# EAGLE design Secondary_Board_1.1 (EAGLE 9.5.0)
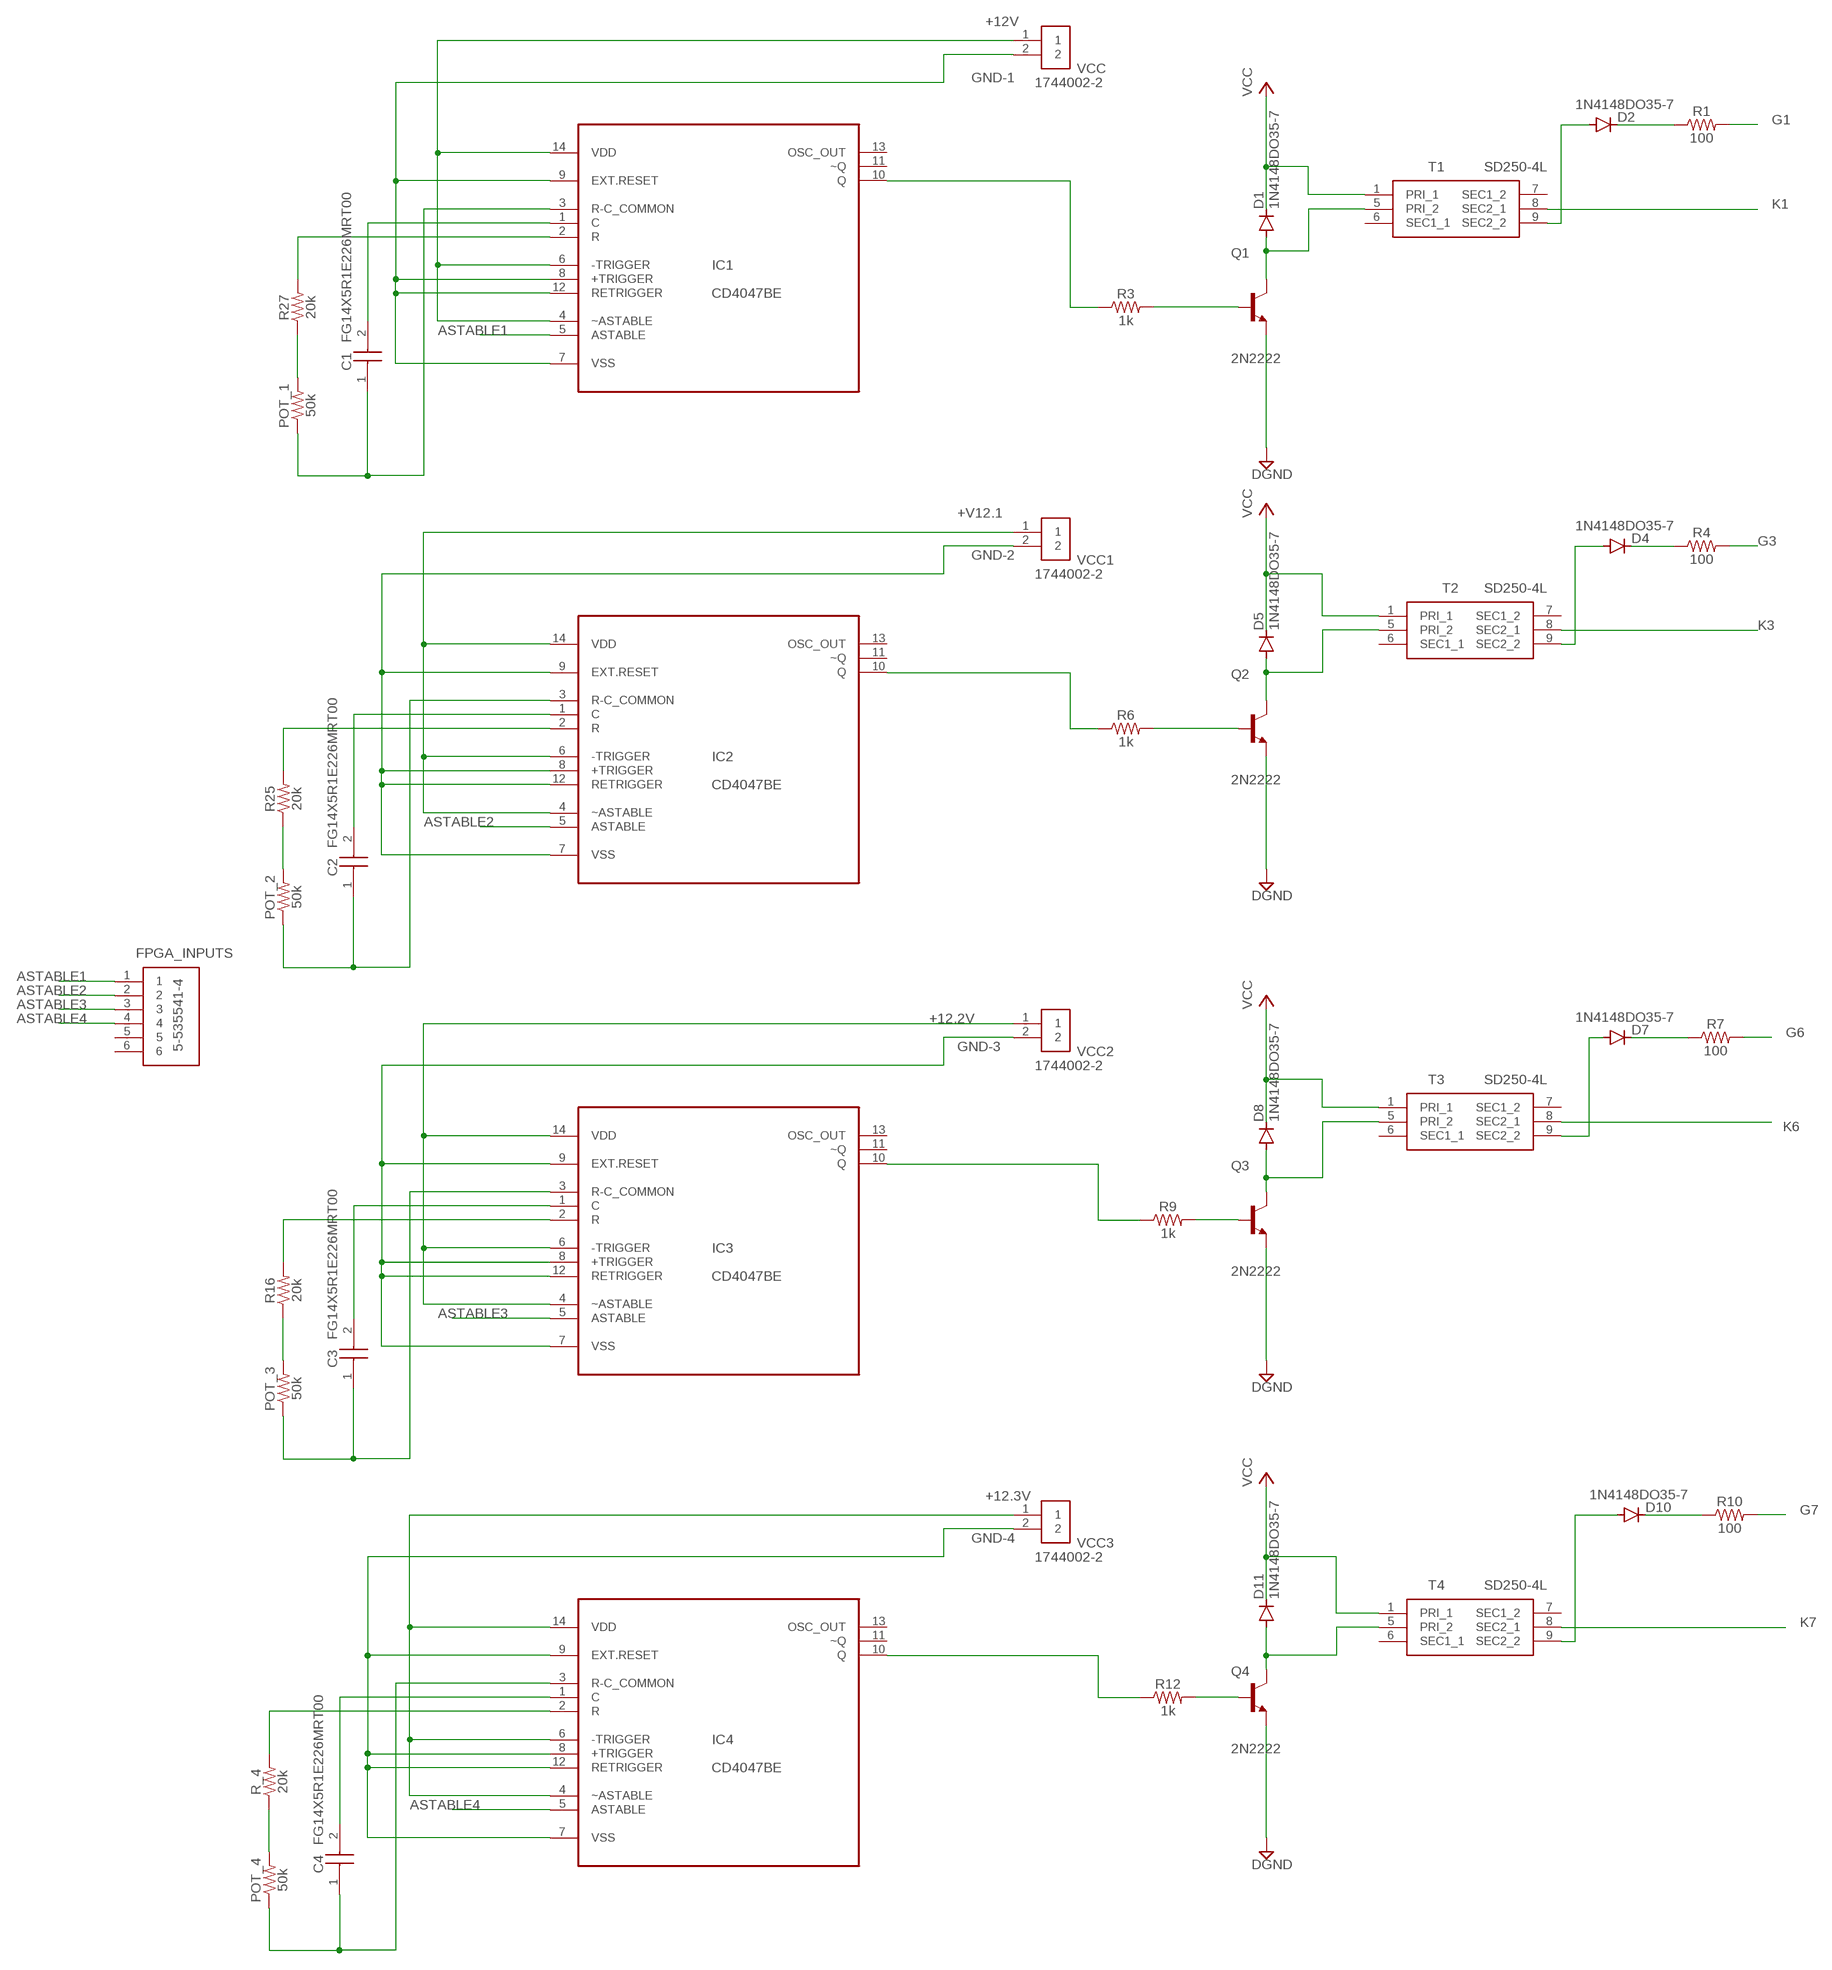
[diagram p0: schematic, sheet 1, part 1 of 2]
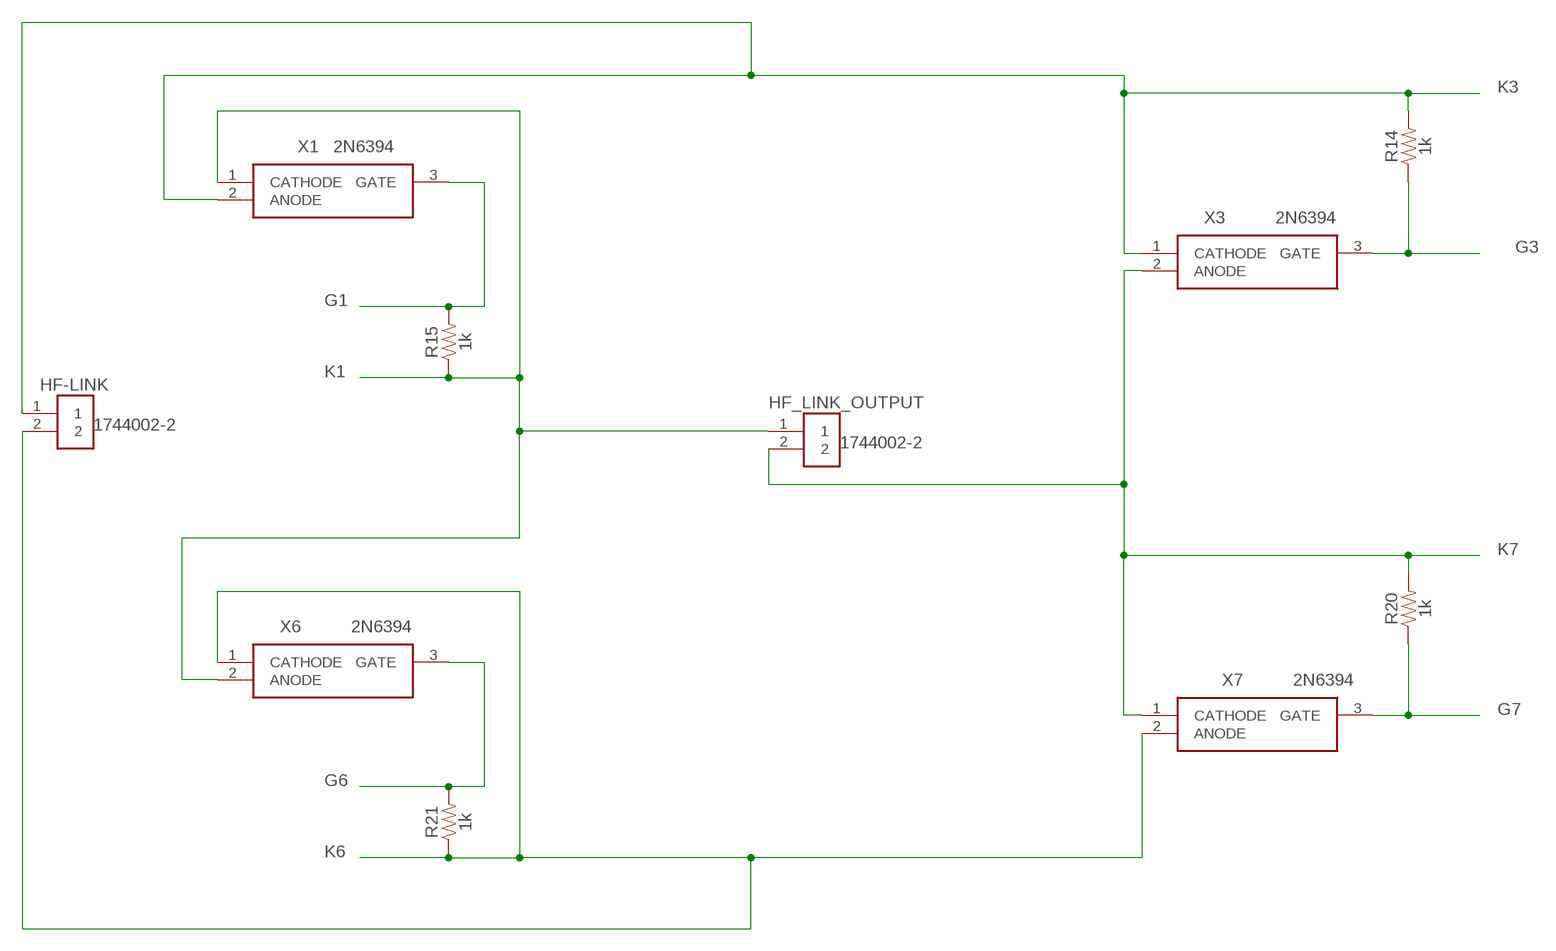
[diagram p1: schematic, sheet 1, part 2 of 2]

## Parts
C1  FG14X5R1E226MRT00  [CAPPRD550W50D395H550]
C2  FG14X5R1E226MRT00  [CAPPRD550W50D395H550]
C3  FG14X5R1E226MRT00  [CAPPRD550W50D395H550]
C4  FG14X5R1E226MRT00  [CAPPRD550W50D395H550]
D1  1N4148DO35-7  [DO35-7]
D2  1N4148DO35-7  [DO35-7]
D4  1N4148DO35-7  [DO35-7]
D5  1N4148DO35-7  [DO35-7]
D7  1N4148DO35-7  [DO35-7]
D8  1N4148DO35-7  [DO35-7]
D10  1N4148DO35-7  [DO35-7]
D11  1N4148DO35-7  [DO35-7]
FPGA_INPUTS  5-535541-4  [SHDR6W76P0X254_1X6_1524X356X62]
HF-LINK  1744002-2  [CONN_1744002-2]
HF_LINK_OUTPUT  1744002-2  [CONN_1744002-2]
IC1  CD4047BE  [DIP254P762X508-14]
IC2  CD4047BE  [DIP254P762X508-14]
IC3  CD4047BE  [DIP254P762X508-14]
IC4  CD4047BE  [DIP254P762X508-14]
POT_1  50k  1KOHM-HORIZ-1/4W-1%  [AXIAL-0.3]
POT_2  50k  1KOHM-HORIZ-1/4W-1%  [AXIAL-0.3]
POT_3  50k  1KOHM-HORIZ-1/4W-1%  [AXIAL-0.3]
POT_4  50k  1KOHM-HORIZ-1/4W-1%  [AXIAL-0.3]
Q1  2N2222  [TO127P584H533-3]
Q2  2N2222  [TO127P584H533-3]
Q3  2N2222  [TO127P584H533-3]
Q4  2N2222  [TO127P584H533-3]
R1  100  100OHM-HORIZ-1/4W-1%  [AXIAL-0.3]
R3  1k  1KOHM-HORIZ-1/4W-1%  [AXIAL-0.3]
R4  100  100OHM-HORIZ-1/4W-1%  [AXIAL-0.3]
R6  1k  1KOHM-HORIZ-1/4W-1%  [AXIAL-0.3]
R7  100  100OHM-HORIZ-1/4W-1%  [AXIAL-0.3]
R9  1k  1KOHM-HORIZ-1/4W-1%  [AXIAL-0.3]
R10  100  100OHM-HORIZ-1/4W-1%  [AXIAL-0.3]
R12  1k  1KOHM-HORIZ-1/4W-1%  [AXIAL-0.3]
R14  1k  1KOHM-HORIZ-1/4W-1%  [AXIAL-0.3]
R15  1k  1KOHM-HORIZ-1/4W-1%  [AXIAL-0.3]
R16  20k  1KOHM-HORIZ-1/4W-1%  [AXIAL-0.3]
R20  1k  1KOHM-HORIZ-1/4W-1%  [AXIAL-0.3]
R21  1k  1KOHM-HORIZ-1/4W-1%  [AXIAL-0.3]
R25  20k  1KOHM-HORIZ-1/4W-1%  [AXIAL-0.3]
R27  20k  1KOHM-HORIZ-1/4W-1%  [AXIAL-0.3]
R_4  20k  1KOHM-HORIZ-1/4W-1%  [AXIAL-0.3]
T1  SD250-4L  [SD2504L]
T2  SD250-4L  [SD2504L]
T3  SD250-4L  [SD2504L]
T4  SD250-4L  [SD2504L]
VCC  1744002-2  [CONN_1744002-2]
VCC1  1744002-2  [CONN_1744002-2]
VCC2  1744002-2  [CONN_1744002-2]
VCC3  1744002-2  [CONN_1744002-2]
X1  2N6394  [TO254P482X997X2018-3P]
X3  2N6394  [TO254P482X997X2018-3P]
X6  2N6394  [TO254P482X997X2018-3P]
X7  2N6394  [TO254P482X997X2018-3P]

## Nets
+12.2V: IC3.4(~ASTABLE) IC3.6(-TRIGGER) IC3.14(VDD) VCC2.1
+12.3V: IC4.4(~ASTABLE) IC4.6(-TRIGGER) IC4.14(VDD) VCC3.1
+12V: IC1.4(~ASTABLE) IC1.6(-TRIGGER) IC1.14(VDD) VCC.1
+V12.1: IC2.4(~ASTABLE) IC2.6(-TRIGGER) IC2.14(VDD) VCC1.1
ASTABLE1: FPGA_INPUTS.1 IC1.5(ASTABLE)
ASTABLE2: FPGA_INPUTS.2 IC2.5(ASTABLE)
ASTABLE3: FPGA_INPUTS.3 IC3.5(ASTABLE)
ASTABLE4: FPGA_INPUTS.4 IC4.5(ASTABLE)
DGND: Q1.1(E) Q2.1(E) Q3.1(E) Q4.1(E)
G1: R1.P$2 R15.P$2 X1.3(GATE)
G3: R4.P$2 R14.P$1 X3.3(GATE)
G6: R7.P$2 R21.P$2 X6.3(GATE)
G7: R10.P$2 R20.P$1 X7.3(GATE)
GND-1: IC1.7(VSS) IC1.8(+TRIGGER) IC1.9(EXT.RESET) IC1.12(RETRIGGER) VCC.2
GND-2: IC2.7(VSS) IC2.8(+TRIGGER) IC2.9(EXT.RESET) IC2.12(RETRIGGER) VCC1.2
GND-3: IC3.7(VSS) IC3.8(+TRIGGER) IC3.9(EXT.RESET) IC3.12(RETRIGGER) VCC2.2
GND-4: IC4.7(VSS) IC4.8(+TRIGGER) IC4.9(EXT.RESET) IC4.12(RETRIGGER) VCC3.2
K1: HF_LINK_OUTPUT.1 R15.P$1 T1.8(SEC2_1) X1.1(CATHODE) X6.2(ANODE)
K3: HF-LINK.1 R14.P$2 T2.8(SEC2_1) X1.2(ANODE) X3.1(CATHODE)
K6: HF-LINK.2 R21.P$1 T3.8(SEC2_1) X6.1(CATHODE) X7.2(ANODE)
K7: HF_LINK_OUTPUT.2 R20.P$2 T4.8(SEC2_1) X3.2(ANODE) X7.1(CATHODE)
N$1: D5.A Q2.3(C) T2.5(PRI_2)
N$2: D1.A Q1.3(C) T1.5(PRI_2)
N$3: D2.C R1.P$1
N$4: IC1.10(Q) R3.P$1
N$5: Q1.2(B) R3.P$2
N$6: D4.A T2.9(SEC2_2)
N$7: IC2.10(Q) R6.P$1
N$8: IC3.10(Q) R9.P$1
N$9: IC4.10(Q) R12.P$1
N$11: D4.C R4.P$1
N$12: D7.A T3.9(SEC2_2)
N$13: Q2.2(B) R6.P$2
N$14: D10.A T4.9(SEC2_2)
N$15: D2.A T1.9(SEC2_2)
N$21: D8.A Q3.3(C) T3.5(PRI_2)
N$24: D7.C R7.P$1
N$25: IC1.2(R) R27.P$2
N$26: POT_1.P$2 R27.P$1
N$27: C1.2(-) IC1.1(C)
N$28: C1.1(+) IC1.3(R-C_COMMON) POT_1.P$1
N$30: IC2.2(R) R25.P$2
N$31: POT_2.P$2 R25.P$1
N$32: C2.2(-) IC2.1(C)
N$33: Q3.2(B) R9.P$2
N$34: C2.1(+) IC2.3(R-C_COMMON) POT_2.P$1
N$36: D11.A Q4.3(C) T4.5(PRI_2)
N$37: D10.C R10.P$1
N$38: IC3.2(R) R16.P$2
N$39: Q4.2(B) R12.P$2
N$40: POT_3.P$2 R16.P$1
N$41: C3.2(-) IC3.1(C)
N$42: C3.1(+) IC3.3(R-C_COMMON) POT_3.P$1
N$44: IC4.2(R) R_4.P$2
N$45: POT_4.P$2 R_4.P$1
N$46: C4.2(-) IC4.1(C)
N$47: C4.1(+) IC4.3(R-C_COMMON) POT_4.P$1
VCC: D1.C D5.C D8.C D11.C T1.1(PRI_1) T2.1(PRI_1) T3.1(PRI_1) T4.1(PRI_1)
Unconnected: FPGA_INPUTS.5 FPGA_INPUTS.6 IC1.11(~Q) IC1.13(OSC_OUT) IC2.11(~Q) IC2.13(OSC_OUT) IC3.11(~Q) IC3.13(OSC_OUT) IC4.11(~Q) IC4.13(OSC_OUT) T1.6(SEC1_1) T1.7(SEC1_2) T2.6(SEC1_1) T2.7(SEC1_2) T3.6(SEC1_1) T3.7(SEC1_2) T4.6(SEC1_1) T4.7(SEC1_2)

## Library data of the parts
C1-C4 = FG14X5R1E226MRT00:FG14X5R1E226MRT00: Multilayer Ceramic Capacitors MLCC - Leaded RAD 25V 22uF X5R 20% LS:2.5mm Source: Datasheet <https://mouser.componentsearchengine.com/Datasheets/1/FG14X5R1E226MRT00.pdf>; DESCRIPTION: Multilayer Ceramic Capacitors MLCC - Leaded RAD 25V 22uF X5R 20% LS:2.5mm; HEIGHT: 5.5mm; MANUFACTURER_NAME: TDK; MANUFACTURER_PART_NUMBER: FG14X5R1E226MRT00
D1 D2 D4 D5 D7 D8 D10 D11 = diode:1N4148: DIODE high speed (Philips)
FPGA_INPUTS = 5-535541-4:5-535541-4: AMP - TE CONNECTIVITY - 5-535541-4 - BOARD-BOARD CONNECTOR, RECEPTACLE, 6 POSITION, 1ROW Source: Datasheet <http://www.te.com/commerce/DocumentDelivery/DDEController?Action=showdoc&DocId=Customer Drawing535541N6pdfEnglishENG_CD_535541_N6.pdf5-535541-4>; ALLIED_NUMBER: 71210170; ALLIED_PRICE-STOCK: https://www.alliedelec.com/te-connectivity-5-535541-4/71210170/; DESCRIPTION: AMP - TE CONNECTIVITY - 5-535541-4 - BOARD-BOARD CONNECTOR, RECEPTACLE, 6 POSITION, 1ROW; HEIGHT: 6.22mm; MANUFACTURER_NAME: TE Connectivity; MANUFACTURER_PART_NUMBER: 5-535541-4; MOUSER_PART_NUMBER: 571-5-535541-4; MOUSER_PRICE-STOCK: https://www.mouser.com/Search/Refine.aspx?Keyword=571-5-535541-4
HF-LINK HF_LINK_OUTPUT VCC VCC1-VCC3 = 1744002-2:1744002-2: CONN HEADER VERT 2POS 3.96MM; AVAILABILITY: Unavailable; DESCRIPTION: CONN HEADER VERT 2POS 3.96MM; MF: TE Connectivity; MP: 1744002-2; PACKAGE: None; PRICE: None; TE_PURCHASE_URL: https://www.te.com/usa-en/product-1744002-2.html?te_bu=Cor&te_type=disp&te_campaign=seda_glo_cor-seda-global-disp-prtnr-fy19-seda-model-bom-cta_sma-317_1&elqCampaignId=32493
IC1-IC4 = CD4047BE:CD4047BE: CMOS Low Power Monostable/Astable Multivibrator; AVAILABILITY: Unavailable; DESCRIPTION: CMOS Low-Power Monostable/Astable Multivibrator 14-PDIP -55 to 125; MF: Texas Instruments; MP: CD4047BE; PACKAGE: DIP-14 Texas Instruments; PRICE: None
POT_1-POT_4 R16 R25 R27 R_4 = SparkFun-Resistors:1KOHM: 1kΩ resistor A resistor is a passive two-terminal electrical component that implements electrical resistance as a circuit element. Resistors act to reduce current flow, and, at the same time, act to lower voltage levels within circuits. - Wikipedia; PROD_ID: RES-12182; VALUE: 1k
Q1-Q4 = 2N2222:2N2222: Trans Npn 30v 0.8a To-18; AVAILABILITY: Unavailable; DESCRIPTION: Silicon Transistor NPN , BULK; MF: Central Semiconductor; MP: 2N2222; PACKAGE: TO-18 Central Semiconductor; PRICE: None
R1 R4 R7 R10 = SparkFun-Resistors:100OHM: 100Ω resistor A resistor is a passive two-terminal electrical component that implements electrical resistance as a circuit element. Resistors act to reduce current flow, and, at the same time, act to lower voltage levels within circuits. - Wikipedia; PROD_ID: RES-12181
R3 R6 R9 R12 R14 R15 R20 R21 = SparkFun-Resistors:1KOHM: 1kΩ resistor A resistor is a passive two-terminal electrical component that implements electrical resistance as a circuit element. Resistors act to reduce current flow, and, at the same time, act to lower voltage levels within circuits. - Wikipedia; PROD_ID: RES-12182
T1-T4 = SD250-4L:SD250-4L: Base/Gate Driver Transformers. Lower cost than toroidal equivalents Frequency range of 10 250 kHz and up Industry standard pin centers 3750 Vrms, one minute isolation (hipot) between primary and secondary windings; 1500 Vrms, one minute between secondaries UL1446 Class B (130C) Insulation System (UL File E83628) Source: Datasheet <https://www.coilcraft.com/pdfs/pwrbase.pdf>; DESCRIPTION: Base/Gate Driver Transformers. Lower cost than toroidal equivalents Frequency range of 10 250 kHz and up Industry standard pin centers 3750 Vrms, one minute isolation (hipot) between primary and secondary windings; 1500 Vrms, one minute between secondaries UL1446 Class B (130C) Insulation System (UL File E83628); HEIGHT: 24.13mm; MANUFACTURER_NAME: COILCRAFT; MANUFACTURER_PART_NUMBER: SD250-4L
X1 X3 X6 X7 = 2N6394:2N6394: SCRs 50V 12A Source: Datasheet <https://www.mouser.com/datasheet/2/308/2N6394-D-103254.pdf>; DESCRIPTION: SCRs 50V 12A; HEIGHT: 4.82mm; MANUFACTURER_NAME: ON Semiconductor; MANUFACTURER_PART_NUMBER: 2N6394; MOUSER_PART_NUMBER: 863-2N6394; MOUSER_PRICE-STOCK: https://www.mouser.com/Search/Refine.aspx?Keyword=863-2N6394

## Board
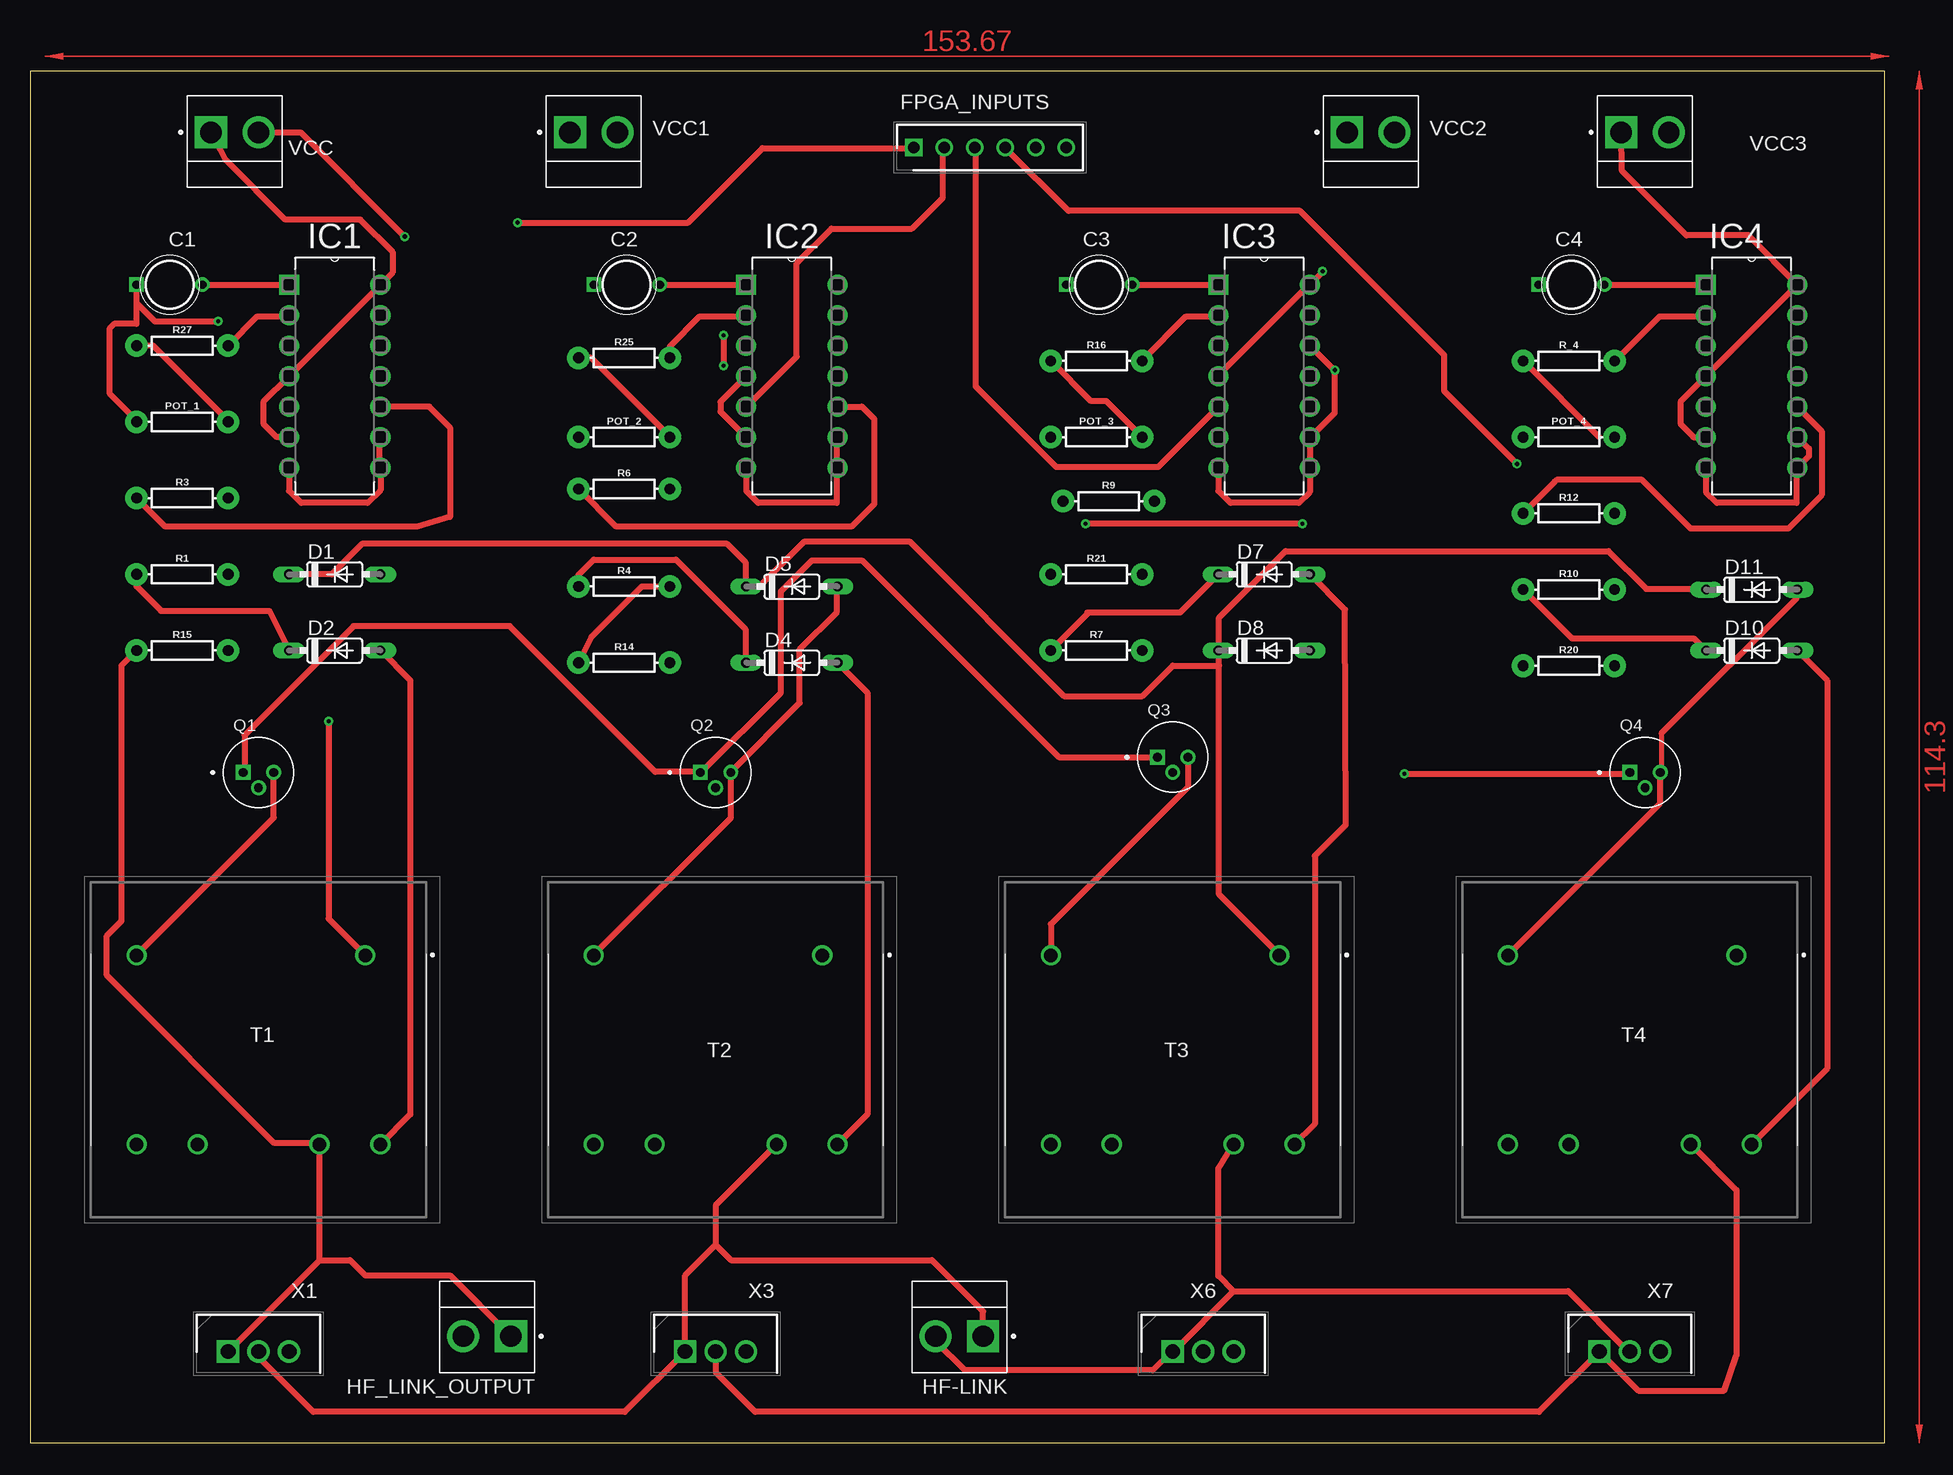
[diagram p2: board, top side]
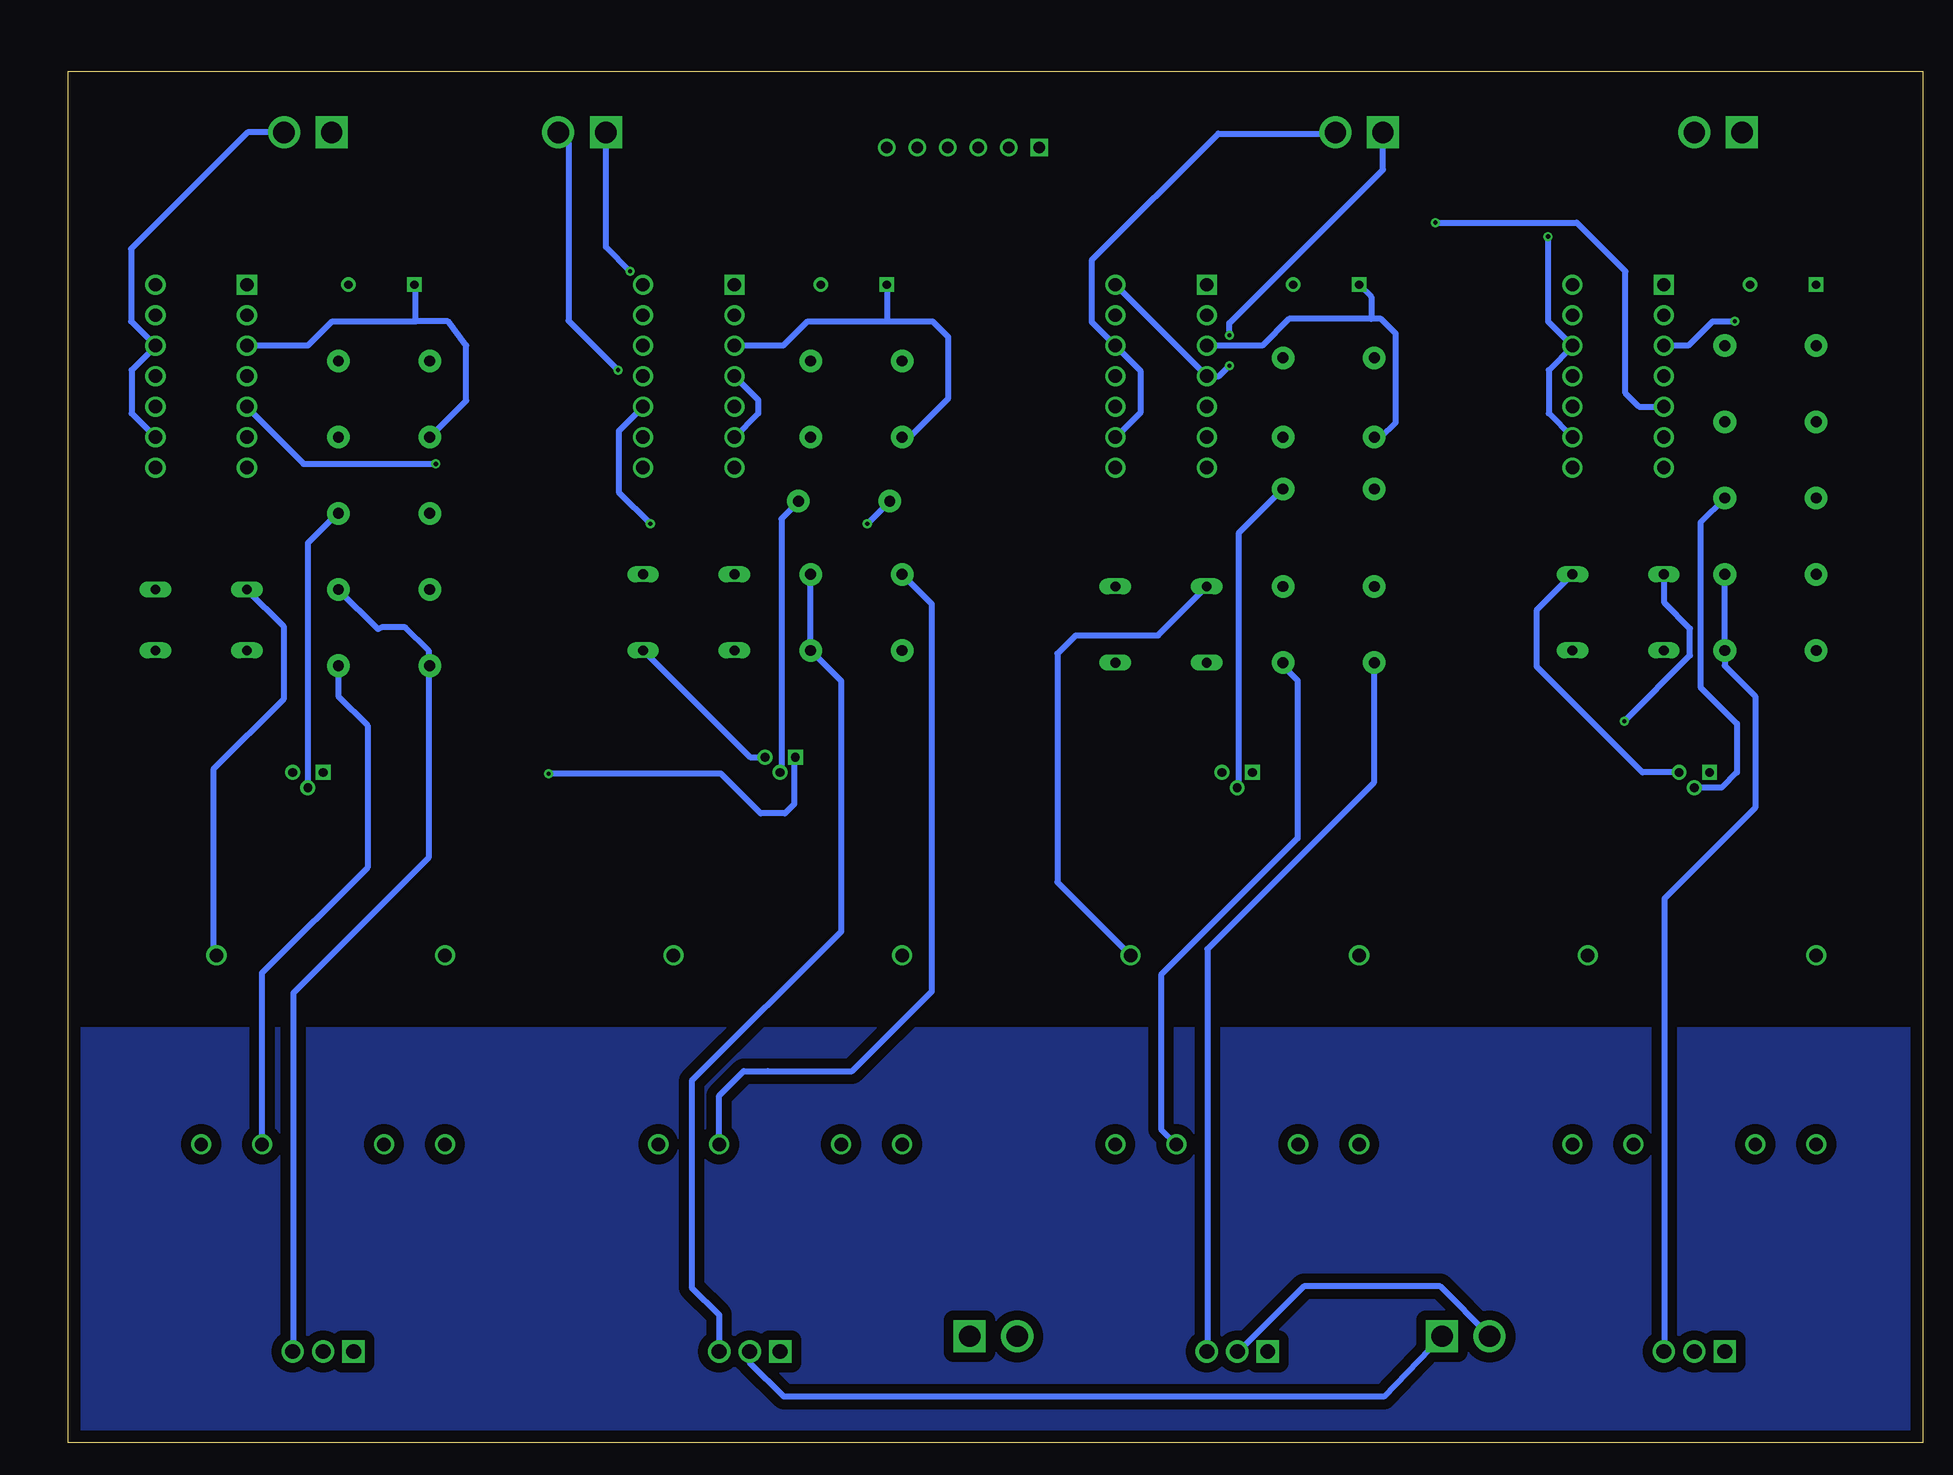
[diagram p3: board, bottom side, seen from below]

Size 154.61 x 114.29 mm. Coordinates in mm from the lower left corner, seen from the top.
Outline: 0,0 154.61,0 154.61,114.29 0,114.29 0,0
Copper layers (1*16): Top 0.035mm / dielectric 1.5mm / Bottom 0.035mm
Design rules "default": minimum track width 6mil, minimum drill 0.35mm, track to track 6mil, track to pad 6mil, pad to pad 6mil, via to via 6mil, smd to smd 6mil, copper to edge 40mil, drill to drill 6mil, minimum pad ring 10mil, minimum via ring 8mil, stop-mask expansion 4mil, vias tented up to drill 0mil, thermal gap 10mil

### Footprints (pad centres in the part's own frame; a part is rotated, then mirrored left to right if it is on the bottom)
CAPPRD550W50D395H550 = drill 0.7 pad 1.1 square: 1 0,0 | drill 0.7 pad 1.1: 2 5.5,0
DO35-7 = drill 0.813 long: A 3.81,0; C -3.81,0
SHDR6W76P0X254_1X6_1524X356X62 = drill 0.95 pad 1.425 square: 1 0,0 | drill 0.95 pad 1.425: 2 2.54,0; 3 5.08,0; 4 7.62,0; 5 10.16,0; 6 12.7,0
CONN_1744002-2 = drill 1.78 square: 1 -1.983,0 | drill 1.78: 2 1.983,0
DIP254P762X508-14 = drill 1.118 square: 1 -7.62,15.24 | drill 1.118: 2 -7.62,12.7; 3 -7.62,10.16; 4 -7.62,7.62; 5 -7.62,5.08; 6 -7.62,2.54; 7 -7.62,0; 8 0,0; 9 0,2.54; 10 0,5.08; 11 0,7.62; 12 0,10.16; 13 0,12.7; 14 0,15.24
AXIAL-0.3 = drill 0.9 pad 1.88: P$1 -3.81,0; P$2 3.81,0
TO127P584H533-3 = drill 0.73 pad 1.13 square: 1 -1.27,0 | drill 0.73 pad 1.13: 2 0,-1.27; 3 1.27,0
SD2504L = drill 1.12 pad 1.68: 1 0,0; 5 -19.05,0; 6 -19.05,-15.75; 7 -13.97,-15.75; 8 -3.81,-15.75; 9 1.27,-15.75
TO254P482X997X2018-3P = drill 1.24 pad 1.86 square: 1 0,0 | drill 1.24 pad 1.86: 2 2.54,0; 3 5.08,0

### Placement (x,y rotation side)
C1  8.89,96.52 0 top
C2  46.99,96.52 0 top
C3  86.36,96.52 0 top
C4  125.73,96.52 0 top
D1  25.4,72.39 0 top
D2  25.4,66.04 0 top
D4  63.5,65.02 0 top
D5  63.5,71.37 0 top
D7  102.87,72.39 0 top
D8  102.87,66.04 0 top
D10  143.51,66.04 0 top
D11  143.51,71.12 0 top
FPGA_INPUTS  73.66,107.95 0 top
HF-LINK  77.47,8.89 180 top
HF_LINK_OUTPUT  38.1,8.89 180 top
IC1  29.21,81.28 0 top
IC2  67.31,81.28 0 top
IC3  106.68,81.28 0 top
IC4  147.32,81.28 0 top
POT_1  12.7,85.09 0 top
POT_2  49.53,83.82 0 top
POT_3  88.9,83.82 0 top
POT_4  128.27,83.82 0 top
Q1  19.05,55.88 0 top
Q2  57.15,55.88 0 top
Q3  95.25,57.15 0 top
Q4  134.62,55.88 0 top
R1  12.7,72.39 0 top
R3  12.7,78.74 0 top
R4  49.53,71.37 0 top
R6  49.53,79.5 0 top
R7  88.9,66.04 0 top
R9  89.92,78.49 0 top
R10  128.27,71.12 0 top
R12  128.27,77.47 0 top
R14  49.53,65.02 0 top
R15  12.7,66.04 0 top
R16  88.9,90.17 0 top
R20  128.27,64.77 0 top
R21  88.9,72.39 0 top
R25  49.53,90.42 0 top
R27  12.7,91.44 0 top
R_4  128.27,90.17 0 top
T1  27.94,40.64 0 top
T2  66.04,40.64 0 top
T3  104.14,40.64 0 top
T4  142.24,40.64 0 top
VCC  17.07,109.22 0 top
VCC1  46.99,109.22 0 top
VCC2  111.76,109.22 0 top
VCC3  134.62,109.22 0 top
X1  16.51,7.62 0 top
X3  54.61,7.62 0 top
X6  95.25,7.62 0 top
X7  130.81,7.62 0 top

### Tracks (layer width: path | path; a pad name or v marks a point on that pad's centre or on a via)
+12.2V  (via drill 0.35)
  Top 0.152: 106.58,96.47 IC3.14 | 99.11,89 IC3.4 | v107.75,97.64 107.7,97.54
  Top 0.508: 99.11,89 106.58,96.47 | IC3.14 107.7,97.54
  Bottom 0.508: IC3.6 97.08,85.8 97.08,86.92 IC3.4 | VCC2.1 109.78,99.67 v107.75,97.64
+12.3V
  Top 0.152: 143.31,100.64 143.26,100.58
  Top 0.508: IC4.6 138.63,83.82 138.63,83.87 137.57,84.94 137.57,86.77 IC4.4 IC4.14 143.26,100.58 | 143.31,100.64 138.07,100.64 132.69,106.02 VCC3.1
+12V
  Top 0.508: IC1.6 20.57,83.82 19.46,84.94 19.46,86.77 IC1.4 IC1.14 30.23,97.54 30.23,99.26 27.53,101.96 21.29,101.96 16.31,106.93 VCC.1
+V12.1  (via drill 0.35)
  Top 0.152: 59.64,83.82 IC2.6
  Top 0.508: 59.64,83.82 59.64,83.87 57.56,85.95 57.56,86.77 IC2.4 | v57.81,92.3 v57.81,89.76
  Bottom 0.152: 45.01,109.12 VCC1.1
  Bottom 0.508: IC2.14 IC2.4 58.67,88.9 v57.81,89.76 | 45.01,109.12 45.01,106.12 57.81,93.32 v57.81,92.3
ASTABLE1  (via drill 0.35)
  Top 0.152: 73.66,107.9 FPGA_INPUTS.1
  Top 0.508: 73.66,107.9 61.06,107.9 54.86,101.7 v40.64,101.7
  Bottom 0.152: 23.72,86.41 23.67,86.36
  Bottom 0.508: v40.64,101.7 28.85,101.7 24.79,97.64 24.79,87.48 23.72,86.41 | 23.67,86.36 IC1.5
ASTABLE2
  Top 0.152: 76.1,107.9 FPGA_INPUTS.2 | 59.79,86.41 IC2.5
  Top 0.508: 76.1,107.9 76.1,103.78 73.51,101.19 66.8,101.19 63.91,98.3 63.91,90.53 59.79,86.41
ASTABLE3
  Top 0.152: 78.84,107.9 FPGA_INPUTS.3
  Top 0.508: 78.84,107.9 78.84,88.04 85.55,81.33 94.03,81.33 IC3.5
ASTABLE4  (via drill 0.35)
  Top 0.508: FPGA_INPUTS.4 86.56,102.67 105.87,102.67 117.86,90.68 117.86,87.68 v123.95,81.58
  Bottom 0.152: 139.65,86.26 IC4.5
  Bottom 0.508: v123.95,81.58 134.98,81.58 139.65,86.26
DGND  (via drill 0.35)
  Top 0.152: 17.88,55.93 Q1.1 | 55.83,55.93 Q2.1 55.98,55.93 | 133.25,55.78 Q4.1
  Top 0.508: 17.88,55.93 17.88,58.98 26.97,68.07 39.98,68.07 52.12,55.93 55.83,55.93 | Q3.1 85.75,57.15 69.34,73.56 65.18,73.56 62.59,70.97 62.59,62.53 55.98,55.93 | v114.55,55.78 133.25,55.78
  Bottom 0.152: 94.08,57.15 Q3.1
  Bottom 0.508: v114.55,55.78 100.18,55.78 96.88,52.48 94.84,52.48 94.08,53.24 94.08,57.15
G1
  Bottom 0.152: 21.54,7.62 X1.3
  Bottom 0.508: 21.54,7.62 21.54,45.36 13.97,52.93 13.97,62.23 16.51,64.77 R15.P$2 R1.P$2
G3
  Top 0.508: R4.P$2 51,71.37 46.79,67.16 R14.P$1
  Bottom 0.152: 59.64,7.62 X3.3 | 45.77,64.97 R14.P$1
  Bottom 0.508: 59.64,7.62 59.64,41.15 45.77,55.02 45.77,64.97
G6
  Bottom 0.508: X6.3 100.33,10.67 102.62,12.95 102.62,30.18 90.17,42.62 90.17,63.5 R7.P$2 R21.P$2
G7
  Bottom 0.152: 135.84,7.62 X7.3 | 124.56,64.77 R20.P$1
  Bottom 0.508: 135.84,7.62 135.84,37.49 124.56,48.77 124.56,64.77 124.56,66.04 126.49,67.97 128.47,67.97 128.78,67.82 R10.P$2
GND-1  (via drill 0.35)
  Top 0.152: 29.16,83.82 IC1.9 | 29.16,81.38 IC1.8
  Top 0.508: IC1.7 21.59,79.35 22.61,78.33 28.14,78.33 29.21,79.4 IC1.8 | 29.16,81.38 29.16,83.82 | v31.24,100.53 22.55,109.22 VCC.2
  Bottom 0.152: 29.16,91.44 IC1.12
  Bottom 0.508: IC1.9 31.19,85.8 31.19,89.41 29.16,91.44 | v31.24,100.53 31.24,93.47 IC1.12
GND-2
  Top 0.152: 67.26,83.82 IC2.9 | 67.26,81.38 IC2.8
  Top 0.508: IC2.7 59.69,79.35 60.71,78.33 67.26,78.33 67.26,81.38 67.26,83.82
  Bottom 0.152: 67.26,91.39 67.26,91.44 IC2.12 | 67.26,83.82 IC2.9 | 49.12,109.12 VCC1.2
  Bottom 0.508: IC2.12 69.29,93.42 69.29,98.55 58.73,109.12 49.12,109.12 | 67.26,91.39 65.18,89.31 65.18,85.9 67.26,83.82
GND-3  (via drill 0.35)
  Top 0.152: 106.73,81.38 IC3.8 | 106.73,83.82 IC3.9
  Top 0.508: IC3.8 106.68,79.25 105.77,78.33 100.08,78.33 99.06,79.35 IC3.7 | 106.73,81.38 106.73,83.82 108.76,85.85 v108.76,89.41 108.71,89.41 IC3.12
  Bottom 0.508: VCC2.2 112.89,108.36 112.89,93.53 v108.76,89.41
GND-4
  Top 0.152: 147.27,81.38 IC4.8
  Top 0.508: IC4.7 139.7,79.25 140.61,78.33 147.27,78.33 147.27,81.38 | IC4.9 148.28,82.86 148.28,82.25 IC4.8
  Bottom 0.152: 147.27,91.44 IC4.12
  Bottom 0.508: IC4.9 149.3,85.8 149.3,89.41 147.27,91.44 | IC4.12 149.35,93.47 149.35,99.52 139.65,109.22 VCC3.2
GROUND_PLANE
  pour Bottom (isolate 0.813): 0.25,34.54 154.69,34.54 154.69,0 0.25,0
K1
  Top 0.152: 24.13,24.99 T1.8
  Top 0.508: 24.13,15.24 T1.8 | X1.1 24.13,15.24 | R15.P$1 7.62,64.77 7.62,43.48 6.4,42.27 6.4,38.96 20.37,24.99 24.13,24.99 | HF_LINK_OUTPUT.1 35,13.97 27.94,13.97 26.67,15.24 24.13,15.24
  Bottom 0.508: X6.2 97.79,6.71 94.94,3.86 44.93,3.86 HF_LINK_OUTPUT.1
K3
  Top 0.508: T2.8 57.15,19.81 57.15,16.51 | 57.15,16.51 54.61,13.97 X3.1 49.58,2.59 23.62,2.59 19.05,7.16 X1.2 | HF-LINK.1 79.45,10.97 75.18,15.24 58.42,15.24 57.15,16.51
  Bottom 0.508: R14.P$2 53.34,64.77 52.12,63.55 52.12,50.39 63.5,39.01 63.5,26.16 T2.8
K6
  Top 0.152: 95.3,7.62 X6.1 95.15,7.62 | 133.25,7.62 X7.2
  Top 0.508: 100.33,12.65 99.06,13.92 99.06,22.86 T3.8 | 95.3,7.62 100.33,12.65 | 133.25,7.62 128.22,12.65 100.33,12.65 | HF-LINK.2 75.49,8.48 77.93,6.04 93.57,6.04 95.15,7.62
  Bottom 0.508: R21.P$1 82.6,69.9 82.6,37.64 89.26,30.99 96.27,30.99 98.3,30.99 100.33,28.95 T3.8
K7
  Top 0.508: T4.8 142.24,21.08 142.24,7.28 141.22,4.36 134.07,4.36 X7.1 125.78,2.59 60.45,2.59 57.15,5.89 X3.2
  Bottom 0.152: 57.05,7.62 X3.2 | 36.17,8.99 HF_LINK_OUTPUT.2
  Bottom 0.508: 57.05,7.62 51.61,13.06 40.23,13.06 36.17,8.99 | R20.P$2 132.08,62.23 129.64,59.79 129.64,47.95 138.43,39.17 T4.8
N$1
  Top 0.152: 46.99,40.69 T2.5 | 67.26,71.37 D5.A | 58.42,55.93 Q2.3
  Top 0.508: Q2.3 58.42,52.12 46.99,40.69 | 67.26,71.37 67.26,69.24 64.16,66.14 64.16,61.67 58.42,55.93
N$2
  Top 0.152: 8.89,40.69 T1.5
  Top 0.508: Q1.3 20.32,52.12 8.89,40.69
  Bottom 0.508: D1.A 32.21,69.39 32.21,64.72 23.37,55.88 Q1.3
N$3
  Top 0.508: R1.P$1 8.89,71.37 10.92,69.34 19.94,69.34 D2.C
N$4
  Top 0.508: IC1.10 33.27,86.36 35.01,84.62 35.01,77.17 32.26,76.35 11.28,76.35 R3.P$1
N$5
  Bottom 0.508: R3.P$2 18.54,76.71 18.54,62.99 15.49,59.94 15.49,55.88 16.76,54.61 Q1.2
N$6
  Top 0.508: T2.9 69.8,27.38 69.8,62.53 D4.A
N$7
  Top 0.508: IC2.10 69.34,86.36 70.36,85.34 70.36,78.23 68.48,76.35 48.87,76.35 R6.P$1
N$8  (via drill 0.35)
  Top 0.508: v106.07,76.61 v87.99,76.61
  Bottom 0.508: IC3.10 108.71,84.33 108.71,79.25 v106.07,76.61 | R9.P$1 v87.99,76.61
N$9
  Top 0.152: 127.25,80.26 127.1,80.11
  Top 0.508: IC4.10 149.35,84.33 149.35,78.99 146.56,76.2 138.43,76.2 134.37,80.26 127.25,80.26 | R12.P$1 127.1,80.11
N$11
  Top 0.152: 59.64,65.13 D4.C | 45.72,72.34 R4.P$1
  Top 0.508: 59.64,65.13 59.64,67.82 53.85,73.61 46.99,73.61 45.72,72.34
N$12
  Top 0.508: D7.A 109.61,69.46 109.68,51.52 107.09,48.92 107.09,26.57 T3.9
N$13
  Bottom 0.152: 57.05,54.71 Q2.2
  Bottom 0.508: 57.05,54.71 57.05,75.79 R6.P$2
N$14
  Top 0.152: 143.61,24.99 T4.9
  Top 0.508: D10.A 149.81,63.55 149.81,31.19 143.61,24.99
N$15
  Top 0.508: T1.9 31.7,27.38 31.7,63.55 D2.A
N$21
  Top 0.508: T3.5 85.09,43.23 96.52,54.66 Q3.3
  Bottom 0.152: 106.58,65.99 D8.A
  Bottom 0.508: Q3.3 97.74,57.15 106.58,65.99
N$24
  Top 0.152: 88.14,69.19 88.14,69.09
  Top 0.508: D7.C 95.86,69.19 88.14,69.19 | 88.14,69.09 R7.P$1
N$25
  Top 0.152: 21.54,93.88 IC1.2
  Top 0.508: 21.54,93.88 18.95,93.88 R27.P$2
N$26
  Top 0.152: 16.51,85.19 POT_1.P$2
  Top 0.508: R27.P$1 10.26,91.44 16.51,85.19
N$27
  Top 0.152: 14.53,96.47 C1.2 | 21.54,96.47 IC1.1
  Top 0.508: 21.54,96.47 14.53,96.47
N$28  (via drill 0.35)
  Top 0.152: 8.89,85.19 POT_1.P$1
  Top 0.508: 8.89,95 8.89,93.27 7.01,93.27 6.65,92.91 6.65,87.43 8.89,85.19 | 8.89,95 C1.1 | 8.89,95 10.41,93.47 v15.69,93.47
  Bottom 0.508: v15.69,93.47 17.53,93.47 19.56,91.44 IC1.3
N$30
  Top 0.152: 59.64,93.88 IC2.2
  Top 0.508: 59.64,93.88 55.83,93.88 53.34,91.39 R25.P$2
N$31
  Top 0.152: 53.39,83.82 POT_2.P$2
  Top 0.508: 53.39,83.82 46.79,90.42 R25.P$1
N$32
  Top 0.152: 52.63,96.47 C2.2 | 59.64,96.47 IC2.1
  Top 0.508: 59.64,96.47 52.63,96.47
N$33
  Bottom 0.152: 95.15,55.93 Q3.2
  Bottom 0.508: 95.15,55.93 95.15,77.01 93.73,78.44 R9.P$2
N$34
  Bottom 0.152: POT_2.P$1 45.16,83.82
  Bottom 0.508: C2.1 45.97,95.5 45.97,93.67 | 45.16,83.82 43.94,85.04 43.94,92.46 45.16,93.67 45.97,93.67 | IC2.3 55.07,91.44 52.83,93.67 45.97,93.67
N$36
  Top 0.152: 147.27,70.41 147.27,71.02 D11.A | 135.99,55.93 Q4.3 135.84,55.78
  Top 0.406: 135.99,59.13 135.99,55.93
  Top 0.508: 147.27,70.41 135.99,59.13 | T4.5 135.84,53.29 135.84,55.78
N$37
  Top 0.508: D10.C 138.68,67.06 128.52,67.06 R10.P$1
N$38
  Top 0.152: 98.96,93.88 IC3.2 | 92.71,90.22 R16.P$2
  Top 0.508: 98.96,93.88 96.37,93.88 92.71,90.22
N$39
  Bottom 0.152: 132.18,77.42 R12.P$2
  Bottom 0.508: Q4.2 134.62,74.98 132.18,77.42
N$40
  Top 0.508: POT_3.P$2 89.71,86.82 88.44,86.82 R16.P$1
N$41
  Top 0.152: 91.95,96.47 C3.2 | 98.96,96.47 IC3.1
  Top 0.508: 98.96,96.47 91.95,96.47
N$42
  Bottom 0.152: POT_3.P$1 84.48,83.82 | 86.31,96.47 C3.1
  Bottom 0.508: 86.31,93.47 86.31,96.47 | 84.48,83.82 81.23,87.07 81.23,92.15 82.55,93.47 86.31,93.47 | 86.31,93.47 92.96,93.47 95,91.44 IC3.3
N$44
  Top 0.152: 139.65,93.88 IC4.2 | 132.18,90.22 R_4.P$2
  Top 0.508: 139.65,93.88 135.84,93.88 132.18,90.22
N$45
  Top 0.152: 130.81,83.82 POT_4.P$2
  Top 0.508: R_4.P$1 130.81,83.82
N$46
  Top 0.152: 131.27,96.47 C4.2 | 139.65,96.47 IC4.1
  Top 0.508: 139.65,96.47 131.27,96.47
N$47
  Bottom 0.152: 125.63,96.47 C4.1
  Bottom 0.508: 125.63,93.47 125.63,96.47 | POT_4.P$1 121.41,86.87 121.41,91.44 122.94,93.47 125.63,93.47 | 125.63,93.47 132.59,93.47 134.62,91.44 IC4.3
VCC  (via drill 0.35)
  Top 0.152: 99.11,65.99 D8.C 99.11,66.14 | 104.14,40.69 T3.1 | 139.65,71.17 D11.C
  Top 0.508: v24.89,60.15 24.89,43.69 T1.1 | 99.11,64.77 99.11,45.72 104.14,40.69 | 99.11,64.77 99.11,65.99 | 99.11,64.77 95.25,64.77 92.71,62.23 86.21,62.23 73.3,75.13 64.57,75.13 60.81,71.37 D5.C 59.64,71.42 59.64,73.41 58.12,74.93 27.69,74.93 25.15,72.39 D1.C | 139.65,71.17 134.72,71.17 131.57,74.32 104.65,74.32 99.11,68.78 99.11,66.14
  Bottom 0.152: 21.54,72.34 D1.C
  Bottom 0.406: T4.1 142.49,40.89
  Bottom 0.508: 21.54,72.34 21.54,70 19.41,67.87 19.41,65.63 v24.89,60.15 | 142.49,40.89 142.49,56.13 136.65,61.98 136.65,68.07 D11.C | D5.C 63.75,67.31 70.61,67.31 72.14,65.79 72.14,46.74 T2.1
(copper drawn outside any net)
  shapes: Top area x2